# EAGLE design ESP32_Thing_Plus (EAGLE 9.6.2)
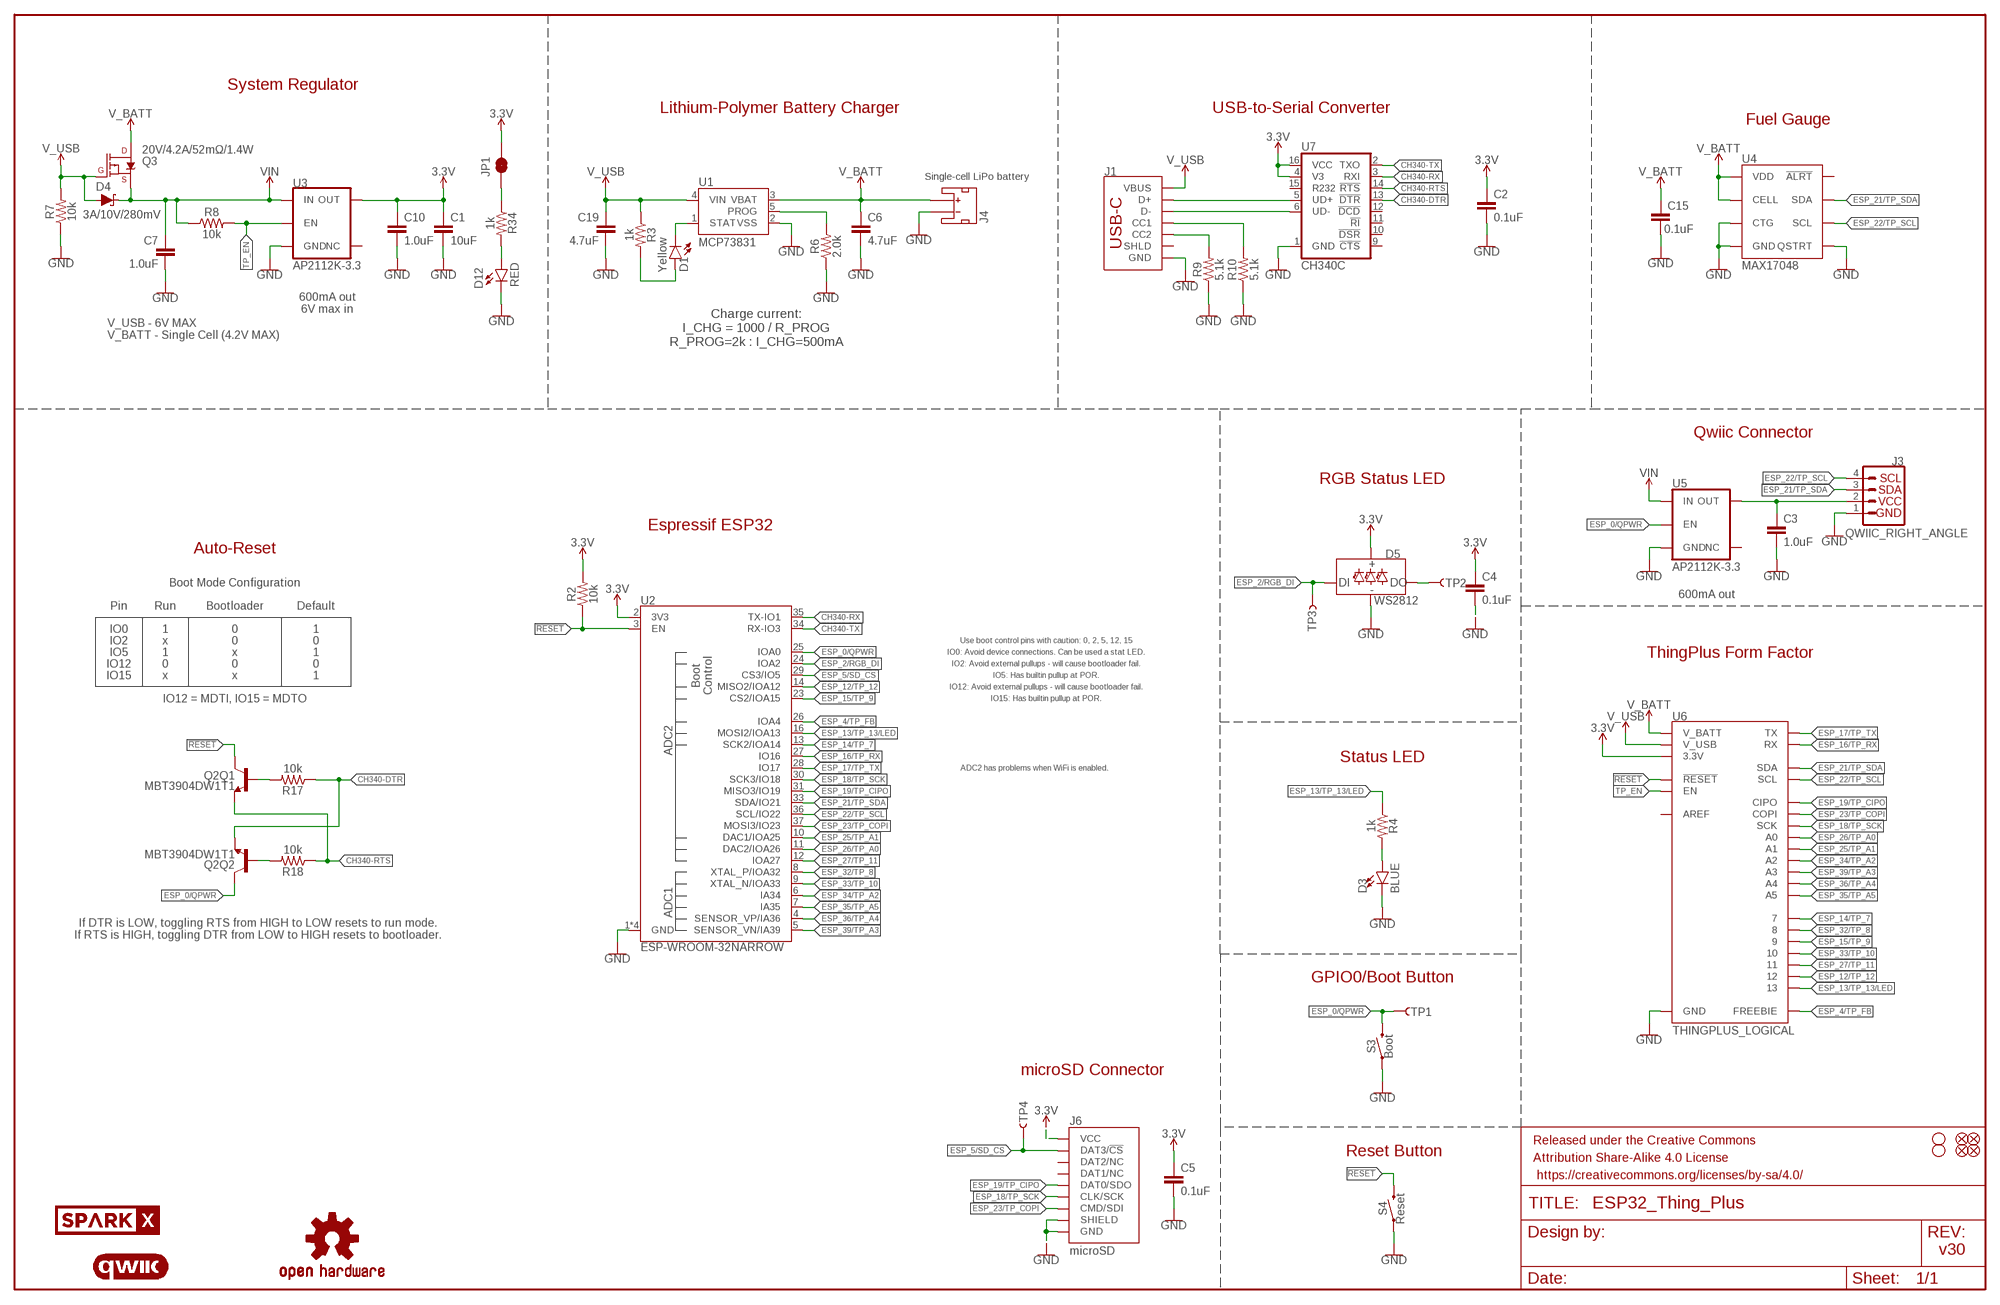
[diagram p0: schematic, sheet 1, part 1 of 2]
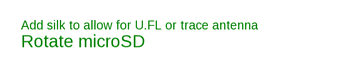
[diagram p1: schematic, sheet 1, part 2 of 2]

## Parts
C1  10uF  10UF-0402T-6.3V-20%  [0402-TIGHT]
C2  0.1uF  0.1UF-0402T-6.3V-10%-X7R  [0402-TIGHT]
C3  1.0uF  1.0UF-0402T-16V-10%  [0402-TIGHT]
C4  0.1uF  0.1UF-0402T-6.3V-10%-X7R  [0402-TIGHT]
C5  0.1uF  0.1UF-0402T-6.3V-10%-X7R  [0402-TIGHT]
C6  4.7uF  4.7UF-0402_TIGHT-6.3V-20%-X5R  [0402-TIGHT]
C7  1.0uF  1.0UF-0402T-16V-10%  [0402-TIGHT]
C10  1.0uF  1.0UF-0402T-16V-10%  [0402-TIGHT]
C15  0.1uF  0.1UF-0402T-16V-10%  [0402-TIGHT]
C19  4.7uF  4.7UF-0603-35V-(20%)  [0603]
D1  Yellow  LED-YELLOW0603  [LED-0603]
D3  BLUE  LED-BLUE0603  [LED-0603]
D4  3A/10V/280mV  DIODE-SCHOTTKY-BAT60A  [SOD-323]
D5  WS2812  WS2812_2020  [WS2812-2020]
D12  RED  LED-RED0603  [LED-0603]
FD1  FIDUCIALUFIDUCIAL  [FIDUCIAL-MICRO]
FD2  FIDUCIALUFIDUCIAL  [FIDUCIAL-MICRO]
FD3  FIDUCIALUFIDUCIAL  [FIDUCIAL-MICRO]
FD4  FIDUCIALUFIDUCIAL  [FIDUCIAL-MICRO]
FRAME1  FRAME-LEDGER  [CREATIVE_COMMONS]
H1  STAND-OFFTIGHT  [STAND-OFF-TIGHT]
H2  STAND-OFFTIGHT  [STAND-OFF-TIGHT]
J1  USB_C_2-LAYER_PADS  [USB-C-16P-2LAYER-PADS]
J3  QWIIC_RIGHT_ANGLE  QWIIC_CONNECTORJS-1MM  [JST04_1MM_RA]
J4  JST_2MM_MALE  [JST-2-SMD]
J6  microSD  MICRO-SD-SDIOPUSH-PUSH  [MICRO-SD-SOCKET]
JP1  JUMPER-SMT_2_NC_TRACE_SILK  [SMT-JUMPER_2_NC_TRACE_SILK]
LOGO2  OSHW-LOGOMINI  [OSHW-LOGO-MINI]
LOGO4  QWIIC_LOGO_4MM  [QWIIC_4MM]
Q2  MBT3904DW1T1  TRANS_NPN_DUAL-MBT3904DW1T1  [SC70-6]
Q3  20V/4.2A/52mΩ/1.4W  MOSFET_PCH-DMG2305UX-7  [SOT23-3]
R2  10k  10KOHM-0402T-1/16W-1%  [0402-TIGHT]
R3  1k  1KOHM-0402T-1/16W-1%  [0402-TIGHT]
R4  1k  1KOHM-0402T-1/16W-1%  [0402-TIGHT]
R6  2.0k  2.0KOHM-0603-1/10W-5%  [0603]
R7  10k  10KOHM-0402T-1/16W-1%  [0402-TIGHT]
R8  10k  10KOHM-0402T-1/16W-1%  [0402-TIGHT]
R9  5.1k  5.1KOHM-0402T-1/16W-1%  [0402-TIGHT]
R10  5.1k  5.1KOHM-0402T-1/16W-1%  [0402-TIGHT]
R17  10k  10KOHM-0402T-1/16W-1%  [0402-TIGHT]
R18  10k  10KOHM-0402T-1/16W-1%  [0402-TIGHT]
R34  1k  1KOHM-0402T-1/16W-1%  [0402-TIGHT]
S3  Boot  MOMENTARY-SWITCH-SPST-SMD-4.6X2.8MM  [TACTILE_SWITCH_SMD_4.6X2.8MM]
S4  Reset  MOMENTARY-SWITCH-SPST-SMD-4.6X2.8MM  [TACTILE_SWITCH_SMD_4.6X2.8MM]
TP1  TEST-POINT3X5  [PAD.03X.05]
TP2  TEST-POINT3X5  [PAD.03X.05]
TP3  TEST-POINT3X5  [PAD.03X.05]
TP4  TEST-POINT3X5  [PAD.03X.05]
U1  MCP73831  [SOT23-5]
U2  ESP-WROOM-32NARROW  [ESP-WROOM-32-NARROW]
U3  AP2112K-3.3  V_REG_AP2112K-3.3V  [SOT23-5]
U4  MAX17048  MAX17048DFN8  [DFN-8]
U5  AP2112K-3.3  V_REG_AP2112K-3.3V  [SOT23-5]
U6  THINGPLUS_LOGICAL  [THINGPLUS_FOOTPRINT]
U7  CH340C  [SO016]
U$1  SPARKX-LOGO4  [SPARKX-MEDIUM]

## Nets
3.3V [power]: C1.1 C2.1 C4.1 C5.1 C10.1 D5.VCC J6.VCC JP1.2 R2.2 U2.2(3V3) U3.5(OUT) U6.3V3(3.3V) U7.4(V3) U7.16(VCC)
!RESET!: Q2.3(Q1:C) R2.1 S4.3 S4.4 U2.3(EN) U6.RST(!RESET)
CH340-DTR: Q2.1(Q2:E) R17.1 U7.13(!DTR)
CH340-RTS: Q2.4(Q1:E) R18.1 U7.14(!RTS)
CH340-RX: U2.35(TX-IO1) U7.3(RXI)
CH340-TX: U2.34(RX-IO3) U7.2(TXO)
CHG: D1.C U1.1(STAT)
CHG_LED: D1.A R3.2
D+: J1.A6(D+) J1.B6(D+) U7.5(UD+)
D-: J1.A7(D-) J1.B7(D-) U7.6(UD-)
DTR-10K: Q2.5(Q1:B) R17.2
ESP_0/QPWR: Q2.6(Q2:C) S3.3 S3.4 TP1.P$1 U2.25(IOA0) U5.3(EN)
ESP_2/RGB_DI: D5.DI TP3.P$1 U2.24(IOA2)
ESP_4/TP_FB: U2.26(IOA4) U6.FREEBIE
ESP_5/SD_CS: J6.CS/DAT3(DAT3/!CS!) TP4.P$1 U2.29(CS3/IO5)
ESP_12/TP_12: U2.14(MISO2/IOA12) U6.12
ESP_13/TP_13/LED: R4.1 U2.16(MOSI2/IOA13) U6.13
ESP_14/TP_7: U2.13(SCK2/IOA14) U6.7
ESP_15/TP_9: U2.23(CS2/IOA15) U6.9
ESP_16/TP_RX: U2.27(IO16) U6.RX
ESP_17/TP_TX: U2.28(IO17) U6.TX
ESP_18/TP_SCK: J6.SCLK(CLK/SCK) U2.30(SCK3/IO18) U6.SCK
ESP_19/TP_CIPO: J6.DO/DAT0(DAT0/SDO) U2.31(MISO3/IO19) U6.CIPO
ESP_21/TP_SDA: J3.3 U2.33(SDA/IO21) U4.8(SDA) U6.SDA
ESP_22/TP_SCL: J3.4 U2.36(SCL/IO22) U4.7(SCL) U6.SCL
ESP_23/TP_COPI: J6.DI/CMD(CMD/SDI) U2.37(MOSI3/IO23) U6.COPI
ESP_25/TP_A1: U2.10(DAC1/IOA25) U6.A1
ESP_26/TP_A0: U2.11(DAC2/IOA26) U6.A0
ESP_27/TP_11: U2.12(IOA27) U6.11
ESP_32/TP_8: U2.8(XTAL_P/IOA32) U6.8
ESP_33/TP_10: U2.9(XTAL_N/IOA33) U6.10
ESP_34/TP_A2: U2.6(IA34) U6.A2
ESP_35/TP_A5: U2.7(IA35) U6.A5
ESP_36/TP_A4: U2.4(SENSOR_VP/IA36) U6.A4
ESP_39/TP_A3: U2.5(SENSOR_VN/IA39) U6.A3
GND: C1.2 C2.2 C3.2 C4.2 C5.2 C6.2 C7.2 C10.2 C15.2 C19.2 D3.C D5.GND D12.C J1.GND J1.GND2(GND) J3.1 J4.1(-) J6.CD1(SHIELD) J6.GND J6.GND1(GND) J6.GND3(GND) R6.1 R7.1 R9.1 R10.1 S3.1 S3.2 S4.1 S4.2 U1.2(VSS) U2.1(GND) U2.15(GND) U2.38(GND) U2.GND U3.2(GND) U4.1(CTG) U4.4(GND) U4.6(QSTRT) U4.9(GND) U5.2(GND) U6.GND U7.1(GND)
N$1: JP1.1 R34.1
N$2: D3.A R4.2
N$3: D5.DO TP2.P$1
N$5: J1.B5(CC2) R9.2
N$6: J1.A5(CC1) R10.2
N$14: R6.2 U1.5(PROG)
N$30: D12.A R34.2
QWIIC_PWR [power]: C3.1 J3.2 U5.5(OUT)
RTS-10K: Q2.2(Q2:B) R18.2
TP_EN: R8.2 U3.3(EN) U6.EN
V_BATT [power]: C6.1 C15.1 J4.2(+) Q3.3(D) U1.3(VBAT) U4.2(CELL) U4.3(VDD) U6.V_BATT
V_USB [power]: C19.1 D4.A J1.VBUS1(VBUS) J1.VBUS2(VBUS) Q3.1(G) R3.1 R7.2 U1.4(VIN) U6.V_USB
VIN [power]: C7.1 D4.C Q3.2(S) R8.1 U3.1(IN) U5.1(IN)
Unconnected: J1.SHLD1(SHLD) J1.SHLD2(SHLD) J1.SHLD3(SHLD) J1.SHLD4(SHLD) J4.NC1(PAD1) J4.NC2(PAD2) J6.DAT1(DAT1/NC) J6.DAT2(DAT2/NC) U3.4(NC) U4.5(!ALRT) U5.4(NC) U6.AREF U7.9(!CTS) U7.10(!DSR) U7.11(!RI) U7.12(!DCD) U7.15(R232)

## Notes on the sheet
- System Regulator
- Lithium-Polymer Battery Charger | USB-to-Serial Converter
- Fuel Gauge
- Single-cell LiPo battery
- 600mA out
  6V max in
- Charge current:
  I_CHG = 1000 / R_PROG
  R_PROG=2k : I_CHG=500mA
- V_USB - 6V MAX
  V_BATT - Single Cell (4.2V MAX)
- Qwiic Connector
- RGB Status LED
- Espressif ESP32
- Auto-Reset
- Boot Mode Configuration
- 600mA out
- Pin | Run | Bootloader | Default
- IO0 | 1 | 0 | 1
- IO2 | x | 0 | 0 | Use boot control pins with caution: 0, 2, 5, 12, 15
- IO5 | 1 | x | 1 | IO0: Avoid device connections. Can be used a stat LED. | ThingPlus Form Factor
- IO12 | 0 | 0 | 0 | IO2: Avoid external pullups - will cause bootloader fail.
- IO15 | x | x | 1 | IO5: Has builtin pullup at POR.
- IO12: Avoid external pullups - will cause bootloader fail. | Add silk to allow for U.FL or trace antenna
- IO12 = MDTI, IO15 = MDTO | IO15: Has builtin pullup at POR. | Rotate microSD
- Status LED
- ADC2 has problems when WiFi is enabled.
- If DTR is LOW, toggling RTS from HIGH to LOW resets to run mode.
  If RTS is HIGH, toggling DTR from LOW to HIGH resets to bootloader.
- GPIO0/Boot Button
- microSD Connector
- Reset Button
- v30

## Library data of the parts
C1 = SparkFun-Capacitors:10UF: 10.0µF ceramic capacitors A capacitor is a passive two-terminal electrical component used to store electrical energy temporarily in an electric field.; PROD_ID: CAP-14848
C2 C4 C5 = SparkFun-Capacitors:0.1UF: 0.1µF ceramic capacitors A capacitor is a passive two-terminal electrical component used to store electrical energy temporarily in an electric field.; PROD_ID: CAP-14993
C3 C7 C10 = SparkFun-Capacitors:1.0UF: 1µF ceramic capacitors A capacitor is a passive two-terminal electrical component used to store electrical energy temporarily in an electric field.; PROD_ID: CAP-12417
C6 = SparkFun-Capacitors:4.7UF: 4.7µF ceramic capacitors A capacitor is a passive two-terminal electrical component used to store electrical energy temporarily in an electric field.; PROD_ID: CAP-14240
C15 = SparkFun-Capacitors:0.1UF: 0.1µF ceramic capacitors A capacitor is a passive two-terminal electrical component used to store electrical energy temporarily in an electric field.; PROD_ID: CAP-12416
C19 = SparkFun-Capacitors:4.7UF: 4.7µF ceramic capacitors A capacitor is a passive two-terminal electrical component used to store electrical energy temporarily in an electric field.; PROD_ID: CAP-14106
D1 = SparkFun-LED:LED-YELLOW: Yellow SMD LED Used in manufacturing several products at SparkFun. Packages: 0603 - SMD 0603 package[Product Link] <http://www.kingbrightusa.com/product.asp?catalog_name=LED&product_id=APT1608SYCK> 0603 -SMART - SMART SMD 0603 package (more efficient/more expensive) [Product Link] <http://www.osram-os.com/osram_os/en/products/product-catalog/led-light-emitting-diodes/smartled-0603/ly-l29k/index.jsp> LilyPad - SMD1206 package[Product Datasheet] <https://www.sparkfun.com/datasheets/DevTools/LilyPad/Q150YUS4.pdf> SparkFun Products: Blynk Board <https://www.sparkfun.com/products/13794> IOIO-OTG <https://www.sparkfun.com/products/13613> XBee Explorer Serial <https://www.sparkfun.com/products/13225>; PROD_ID: DIO-09003
D3 = SparkFun-LED:LED-BLUE: Blue SMD LED Used in manufacturing of various products at SparkFun Packages: 0603 - SMD 0603 package [Product Link] <http://www.digikey.com/product-detail/en/SMLE12BC7TT86/511-1589-2-ND/1641808> 1206 - SMD1206 package [Product Link] <http://www.digikey.com/product-detail/en/lite-on-inc/LTST-C150TBKT/160-1643-1-ND/573584> SparkFun Products: ESP8266 Thing-Dev Board <https://www.sparkfun.com/products/13711> RedBoard <https://www.sparkfun.com/products/12757>; PROD_ID: DIO-08575
D4 = SparkFun-DiscreteSemi:DIODE-SCHOTTKY: Schottky diode A Schottky diode is a semiconductor diode which has a low forward voltage drop and a very fast switching action.; PROD_ID: DIO-14072
D5 = SparkFun-LED:WS2812: Addressable RGB LED - 1 Wire Common names: WS2812, SK6812, Neopixel, APA-106, etc. SMD LED with built-in controller IC. Color: Red/Green/Blue SparkFun Products: LED-SMD RGB (WS2812) <https://www.sparkfun.com/products/11821> LED - RGB Addressable, PTH, 5mm Diffused (5 Pack) <https://www.sparkfun.com/products/12986> LED - RGB Addressable, PTH, 5mm Clear (5 Pack) <https://www.sparkfun.com/products/12999> Blynk Board - ESP8266 <https://www.sparkfun.com/products/13794> Datasheet referenced for footprint: WS2812B-PTH <https://cdn.sparkfun.com/datasheets/Components/LED/COM-12877.pdf>; PROD_ID: DIO-15591
D12 = SparkFun-LED:LED-RED: Red SMD LED Used in manufacturing of most products at SparkFun Packages: 0603 - SMD 0603 package [Product Link] <http://docs.avagotech.com/docs/AV02-0551EN> 0603 SMART - SMD 0603 SMART package ( more efficient and expensive)[Product Link] <http://www.osram-os.com/Graphics/XPic2/00077099_0.pdf> 1206 - SMD1206 package [Product Link] <https://www.sparkfun.com/datasheets/DevTools/LilyPad/Q150OVS4.pdff> SparkFun Products: Pro Mini 328 -5V <https://www.sparkfun.com/products/821> RedBoard <https://www.sparkfun.com/products/12757> IOIO-OTG <https://www.sparkfun.com/products/13613>; PROD_ID: DIO-00819
FD1-FD4 = SparkFun-Aesthetics:FIDUCIAL: Fiducial Alignment Points Point-of-reference for pick-and-place machines and other optical instruments.
FRAME1 = SparkFun-Aesthetics:FRAME-LEDGER: Schematic Frame - Ledger Standard 11x14 US Ledger frame
H1 H2 = SparkFun-Hardware:STAND-OFF: Stand Off Drill holes for mechanically mounting via screws, standoffs, etc. Note: Use the keepout ring to avoid running the screw head into surrounding components. Variant Overviews STAND-OFF - Mechanical footprint for a #4 phillips button head screw. STAND-OFF-TIGHT - Mechanical footprint for a #4 phillips button head screw, Example SparkFun Products Screw - Phillips Head (1/4", 4-40, 10 pack) <https://www.sparkfun.com/products/10453> (PRT-10453) Screw - Phillips Head (1/2", 4-40, 10 pack) <https://www.sparkfun.com/products/10452> (PRT-10452) Screw - Phillips Head (3/4", 4-40, 10 pack) <https://www.sparkfun.com/products/10451> (PRT-10451) Screw - Phillips Head (1", 4-40, 10 pack) <https://www.sparkfun.com/products/10450> (PRT-10450)
J1 = SparkFun-Connectors:USB_C: USB Type C 16Pin Connector Super Speed pins not available on the 16-pin purely SMD connector so this part is best for USB 2.0 implementations. D1 and D2 are tied together enabling D+/- no matter which way the cable is plugged into the connector. The two channel configuration pins (CC1/2) are exposed. These are normally connected to ground via 5.1k resistors but can be reconfigured for high current/high power applications. **4-LAYER BOARD WARNING!!** If designing 4-layer board, make sure to select the variant _4-LAYER-ISOLATED. The linked footprint (USB-C-16-4LAYER-ISOLATED) includes some very necessary cutout polygons in the inner layers (2 and 15). This prevents the PTH mounting shield legs on the USB connector from electrically connecting any other polygons on the inner layers (usually VCC and GND).; PROD_ID: CONN-14122
J3 = SparkFun-Connectors:QWIIC_CONNECTOR: SparkFun I2C Standard Qwiic Connector An SMD 1mm pitch JST connector makes it easy and quick (get it? Qwiic?) to connect I2C devices to each other. The Qwiic system <http://www.sparkfun.com/qwiic> enables fast and solderless connection between popular platforms and various sensors and actuators. We carry 200mm <https://www.sparkfun.com/products/14204>, 100mm <https://www.sparkfun.com/products/14205>, 50mm <https://www.sparkfun.com/products/14206>, and breadboard friendly <https://www.sparkfun.com/products/14207> Qwiic cables. We also offer 10 pcs strips <https://www.sparkfun.com/products/14323> the SMD connectors.; PROD_ID: CONN-13694
J4 = SparkFun-Connectors:JST_2MM_MALE: JST 2MM MALE RA CONNECTOR Two pin, compact surface mount connector. Commonly used as a battery input connection point. We really like the solid locking feeling and high current rating on these small connectors. We use these all the time as battery connectors. Mates to single-cell LiPo batteries. Here is the connector we sell at SparkFun: JST Right Angle Connector - White <https://www.sparkfun.com/products/8612> (PRT-08612) Datasheet <http://www.sparkfun.com/datasheets/Prototyping/Connectors/JST-Horizontal.pdf> It was used on these SparkFun products: SparkFun MOSFET Power Controller <https://www.sparkfun.com/products/11214> (PRT-11214) SparkFun Battery Babysitter - LiPo Battery Manager <https://www.sparkfun.com/products/13777> (PRT-13777) And many, many others that required a lipo battery connection.; PROD_ID: CONN-11443; SF_ID: PRT-08612
J6 = SparkFun-Connectors:MICRO-SD-SDIO: microSD Socket for Transflash Push-push type µSD socket. tDoc lines correctly indicate media card edge positions when inserting (unlocked, locked, depressed). NOTE: CD1 and CD2 are connected internally, and the default detect state of the socket is detect pin to ground. SparkFun Products: WAV Trigger <https://www.sparkfun.com/products/13660> CAN-Bus Shield <https://www.sparkfun.com/products/13262> SparkFun Level Shifing microSD Breakout <https://www.sparkfun.com/products/13743>; PROD_ID: CONN-07820
JP1 = SparkFun-Jumpers:JUMPER-SMT_2_NC_TRACE: Normally closed trace jumper This jumper has a trace between two pads so it's normally closed (NC). Use a razor knife to open the connection. For best results follow the IPC guidelines for cutting traces: Cutout at least 0.063 mm (0.005 in). Remove all loose material to clean up the cut area. Seal the cut with an approved epoxy. Reapply solder to reclose the connection.
LOGO2 = SparkFun-Aesthetics:OSHW-LOGO: Open-Source Hardware (OSHW) Logo This logo indicates the piece of hardware it is found on incorporates a OSHW license and/or adheres to the definition of open source hardware found here: http://freedomdefined.org/OSHW
LOGO4 = SparkFun-Aesthetics:QWIIC_LOGO: Qwiic Logos for placement on schematic and PCB. The 5.5mm silk logo is best for placing next to Qwiic connector.
Q2 = SparkFun-DiscreteSemi:TRANS_NPN_DUAL: Dual NPN Transistors in Single Package The MBT3904W1 puts two general purpose 3904 NPN transistors in a single package. Datasheet <http://www.onsemi.com/pub_link/Collateral/MBT3904DW1T1-D.PDF> SparkFun Products: SparkFun ESP32 Thing <https://www.sparkfun.com/products/13907>; PROD_ID: TRANS-13337
Q3 = SparkFun-DiscreteSemi:MOSFET_PCH: P-channel MOSFETs Voltage controlled devices that allow control of high current outputs. SparkFun Products: SparkFun ESP32 Thing <https://www.sparkfun.com/products/13907> SparkFun ESP8266 Thing <https://www.sparkfun.com/products/13231> SparkFun Pi Servo HAT V2 <https://www.sparkfun.com/products/15316> DMG2305UX-7 (20V/4.2A/SOT23-3); PROD_ID: TRAN-14388
R2 R7 R8 R17 R18 = SparkFun-Resistors:10KOHM: 10kΩ resistor A resistor is a passive two-terminal electrical component that implements electrical resistance as a circuit element. Resistors act to reduce current flow, and, at the same time, act to lower voltage levels within circuits. - Wikipedia; PROD_ID: RES-14241
R3 R4 R34 = SparkFun-Resistors:1KOHM: 1kΩ resistor A resistor is a passive two-terminal electrical component that implements electrical resistance as a circuit element. Resistors act to reduce current flow, and, at the same time, act to lower voltage levels within circuits. - Wikipedia; PROD_ID: RES-14342
R6 = SparkFun-Resistors:2.0KOHM: 2kΩ resistor A resistor is a passive two-terminal electrical component that implements electrical resistance as a circuit element. Resistors act to reduce current flow, and, at the same time, act to lower voltage levels within circuits. - Wikipedia; PROD_ID: RES-08296
R9 R10 = SparkFun-Resistors:5.1KOHM; PROD_ID: RES-14340
S3 S4 = SparkFun-Switches:MOMENTARY-SWITCH-SPST: Momentary Switch (Pushbutton) - SPST Normally-open (NO) SPST momentary switches (buttons, pushbuttons). Variants PTH-12MM - 12mm square, through-hole Momentary Pushbutton Switch - 12mm Square <https://www.sparkfun.com/products/9190> (COM-09190) PTH-6.0MM, PTH-6.0MM-KIT - 6.0mm square, through-hole Mini Pushbutton Switch <https://www.sparkfun.com/products/97> (COM-00097) KIT package intended for soldering kit's - only one side of pads' copper is exposed. PTH-RIGHT-ANGLE-KIT - Right-angle, through-hole Right Angle Tactile Button <https://www.sparkfun.com/products/10791> - Used on SparkFun BigTime Watch Kit <https://www.sparkfun.com/products/11734> SMD-12MM - 12mm square, surface-mount Tactile Button - SMD (12mm) <https://www.sparkfun.com/products/12993> (COM-12993) Used on SparkFun PicoBoard <https://www.sparkfun.com/products/11888> SMD-4.5MM - 4.5mm Square Trackball Switch Used on SparkFun Blackberry Trackballer Breakout <https://www.sparkfun.com/products/13169> SMD-4.6MMX2.8MM - 4.60mm x 2.80mm, surface mount Used on SparkFun SAMD21 Mini Breakout <https://www.sparkfun.com/products/13664> SMD-5.2MM, SMD-5.2-REDUNDANT - 5.2mm square, surface-mount Mini Pushbutton Switch - SMD <https://www.sparkfun.com/products/8720> (COM-08720) Used on Arduino Pro Mini <https://www.sparkfun.com/products/11114> REDUNDANT package connects both switch circuits together SMD-6.0X3.5MM - 6.0 x 3.5mm, surface mount Momentary Reset Switch SMD <https://www.sparkfun.com/products/8229> (COM-08229) SMD-6.2MM-TALL - 6.2mm square, surface mount Tactile Button - SMD (6mm) <https://www.sparkfun.com/products/12992> Used on SparkFun Digital Sandbox <https://www.sparkfun.com/products/12651> SMD-RIGHT-ANGLE - Right-angle, surface mount Used on SparkFun Block for Intel® Edison - Arduino <https://www.sparkfun.com/products/13036>; PROD_ID: SWCH-15606
TP1-TP4 = SparkFun-Connectors:TEST-POINT: SparkFun Test Points Bare copper test points for troubleshooting or In-Circuit-Testing. These are used by our Production team for verifying production board runs using pogo-pins on test beds. SparkFun Products: SparkFun LSM9DS1 Breakout <https://www.sparkfun.com/products/13284> SparkFun PSOC <https://www.sparkfun.com/products/13714> SparkFun Load Cell Amplifier <https://www.sparkfun.com/products/13879>
U1 = SparkFun-PowerIC:MCP73831: Miniature single cell, fully integrated Li-Ion, Li-polymer charge management controller http://ww1.microchip.com/downloads/en/DeviceDoc/20001984g.pdf IC-09995; PROD_ID: IC-09995
U2 = SparkFun-RF:ESP-WROOM-32; PROD_ID: IC-13849
U3 U5 = SparkFun-IC-Power:V_REG_AP2112: AP2112 - 600mA CMOS LDO Regulator w/ Enable The AP2112 is CMOS process low dropout linear regulator with enable function, the regulator delivers a guaranteed 600mA (min.) continuous load current. Features Output Voltage Accuracy: ±1.5% Output Current: 600mA (Min.) Foldback Short Current Protection: 50mA Enable Function to Turn ON/OFF VOUT Low Dropout Voltage (3.3V): 250mV (Typ.) @IOUT=600mA Excellent Load Regulation: 0.2%/A (Typ.) Excellent Line Regulation: 0.02%/V (Typ.) Low Quiescent Current: 55μA (Typ.) Low Standby Current: 0.01μA (Typ.) Low Output Noise: 50μVRMS PSRR: 100Hz -65dB, 1kHz -65dB OTSD Protection Stable with 1.0μF Flexible Cap: Ceramic, Tantalum and Aluminum Electrolytic Operation Temperature Range: -40°C to 85°C ESD: MM 400V, HBM 4000V; PROD_ID: VREG-12457; VALUE: 3.3V
U4 = SparkFun-IC-Power:MAX17048: Micropower 1-Cell Li+ ModelGauge SparkFun Products Qduino Mini <https://www.sparkfun.com/products/13614> (DEV-13614); PROD_ID: IC-12551
U6 = ThingPlus:THINGPLUS_LOGICAL
U7 = SparkFun-IC-Comms:CH340C; PROD_ID: IC-14038
U$1 = SparkX:SPARKX-LOGO

## Net classes
0 default: width 0.127 mm, drill 0.305 mm
1 power: width 0.305 mm, drill 0.305 mm

## Board
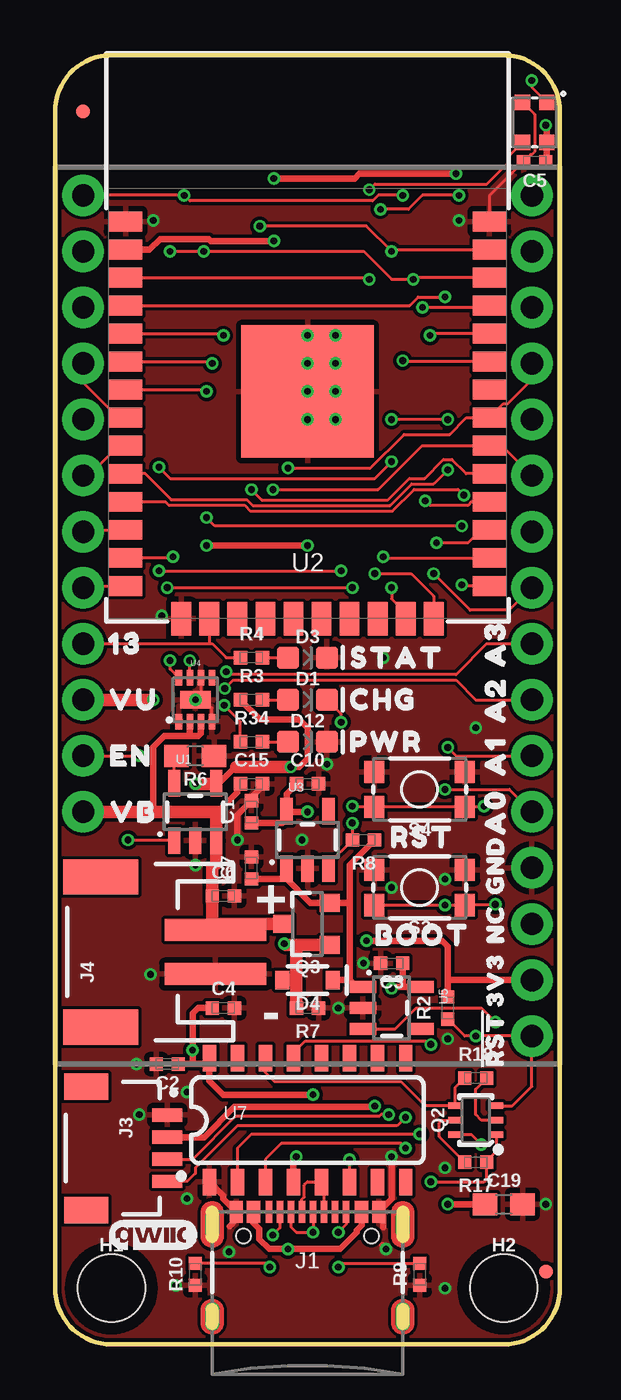
[diagram p2: board, top side]
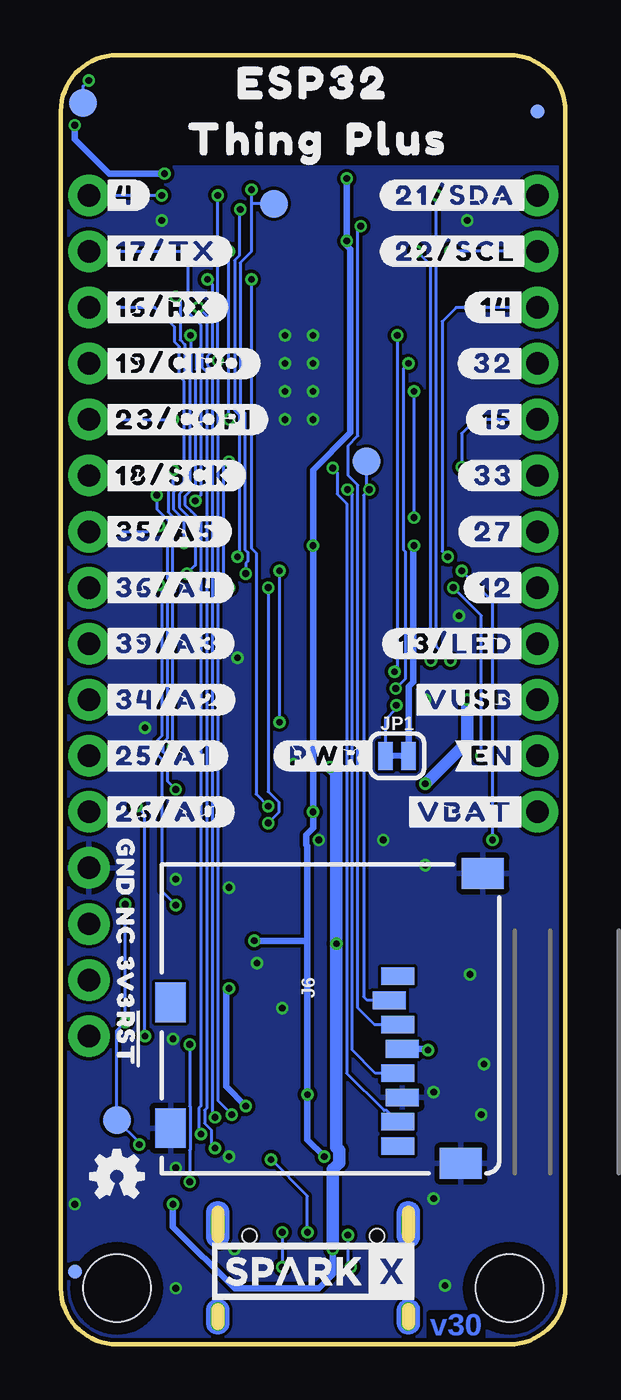
[diagram p3: board, bottom side, seen from below]

Size 22.86 x 58.42 mm. Coordinates in mm from the lower left corner, seen from the top.
Outline: 22.86,2.54 22.86,55.88 arc90 20.32,58.42 2.54,58.42 arc90 0,55.88 0,2.54 arc90 2.54,0 20.32,0 arc90 22.86,2.54
Copper layers (1*16): Top/Horz 0.035mm / dielectric 1.5mm / Bottom/Vert 0.035mm
Design rules "SparkFun-2-Layer-Minimum-JLCPCB": minimum track width 5mil, minimum drill 0.3mm, track to track 5mil, track to pad 5mil, pad to pad 5mil, via to via 5mil, smd to smd 5mil, copper to edge 7mil, drill to drill 7mil, minimum pad ring 5mil, minimum via ring 5mil, stop-mask expansion 4mil, vias tented up to drill 25mil, thermal gap 10mil

### Footprints (pad centres in the part's own frame; a part is rotated, then mirrored left to right if it is on the bottom)
0402-TIGHT = smd 0.6 x 0.6: 1 -0.5,0; 2 0.5,0
0603 = smd 1.1 x 1: 1 -0.85,0; 2 0.85,0
LED-0603 = smd 1 x 1: A -0.877,0; C 0.877,0
SOD-323 = smd 0.63 x 0.83: A 1.15,0; C -1.15,0
WS2812-2020 = smd 0.7 x 0.7: DI -0.915,0.55; DO 0.915,-0.55; GND 0.915,0.55; VCC -0.915,-0.55
FIDUCIAL-MICRO = smd 0.635 x 0.635: 1 0,0
STAND-OFF-TIGHT = hole 3.048: 0,0
USB-C-16P-2LAYER-PADS = smd 0.3 x 1: A5 -1.25,-0.34; A6 -0.25,-0.34; A7 0.25,-0.34; A8 1.25,-0.34; B5 1.75,-0.34; B6 0.75,-0.34; B7 -0.75,-0.34; B8 -1.75,-0.34 | smd 0.6 x 1: GND -3.225,-0.34; GND2 3.225,-0.34; VBUS1 -2.45,-0.34; VBUS2 2.45,-0.34 | drill 0.4 pad 0.6 long: SHLD1 -4.318,-0.915; SHLD2 4.318,-0.915; SHLD3 -4.318,-5.095; SHLD4 4.318,-5.095 | hole 0.65: -2.89,-1.445; 2.89,-1.445
JST04_1MM_RA = smd 0.6 x 1.35: 1 -1.5,0; 2 -0.5,0; 3 0.5,0; 4 1.5,0 | smd 1.2 x 2: NC1 2.8,-3.675; NC2 -2.8,-3.675
JST-2-SMD = smd 1 x 4.6: 1 -1,-3.7; 2 1,-3.7 | smd 1.6 x 3.4: NC1 -3.4,1.5; NC2 3.4,1.5
MICRO-SD-SOCKET = smd 1.8 x 1.4: CD1 -2.05,0.4; CD2 -7.75,0.4 | smd 0.8 x 1.5: CS/DAT3 -7.84,10.3; DAT1 -1.24,10.7; DAT2 -8.94,10.7; DI/CMD -6.74,10.7; DO/DAT0 -2.34,10.7; GND -3.44,10.9; SCLK -4.54,10.7; VCC -5.64,10.9 | smd 1.4 x 1.9: GND1 -13.6,14.55; GND3 -0.45,13.55
SMT-JUMPER_2_NC_TRACE_SILK = smd 0.66 x 1.27: 1 -0.521,0; 2 0.521,0
SC70-6 = smd 0.3 x 0.66: 1 -0.65,-0.92; 2 0,-0.92; 3 0.65,-0.92; 4 0.65,0.92; 5 0,0.92; 6 -0.65,0.92
SOT23-3 = smd 0.8 x 0.9: 1 -0.95,-1; 2 0.95,-1; 3 0,1.1
TACTILE_SWITCH_SMD_4.6X2.8MM = smd 0.9 x 1: 1 -2.05,-0.8; 2 2.05,-0.8; 3 2.05,0.8; 4 -2.05,0.8
PAD.03X.05 = smd 1.27 x 1.27: P$1 0,0
SOT23-5 = smd 0.55 x 1.2: 1 -0.95,-1.3; 2 0,-1.3; 3 0.95,-1.3; 4 0.95,1.3; 5 -0.95,1.3
ESP-WROOM-32-NARROW = smd 0.9 x 1.5: 1 6.43,8.238; 2 5.16,8.238; 3 3.89,8.238; 4 2.62,8.238; 5 1.35,8.238; 6 0.08,8.238; 7 -1.19,8.238; 8 -2.46,8.238; 9 -3.73,8.238; 10 -5,8.238; 11 -6.27,8.238; 12 -7.54,8.238; 13 -8.81,8.238; 14 -10.08,8.238; 25 -10.08,-8.238; 26 -8.81,-8.238; 27 -7.54,-8.238; 28 -6.27,-8.238; 29 -5,-8.238; 30 -3.73,-8.238; 31 -2.46,-8.238; 32 -1.19,-8.238; 33 0.08,-8.238; 34 1.35,-8.238; 35 2.62,-8.238; 36 3.89,-8.238; 37 5.16,-8.238; 38 6.43,-8.238 | smd 1.5 x 0.9: 15 -11.57,5.715; 16 -11.57,4.445; 17 -11.57,3.175; 18 -11.57,1.905; 19 -11.57,0.635; 20 -11.57,-0.635; 21 -11.57,-1.905; 22 -11.57,-3.175; 23 -11.57,-4.445; 24 -11.57,-5.715 | smd 6 x 6: GND -1.27,0
DFN-8 = smd 0.3 x 0.7: 1 -0.75,-0.99; 2 -0.25,-0.99; 3 0.25,-0.99; 4 0.75,-0.99; 5 0.75,0.99; 6 0.25,0.99; 7 -0.25,0.99; 8 -0.75,0.99 | smd 1.38 x 0.8: 9 0,0
THINGPLUS_FOOTPRINT = drill 1.016 pad 1.88: 3V3 10.16,-19.05; 7 -10.16,11.43; 8 -10.16,8.89; 9 -10.16,6.35; 10 -10.16,3.81; 11 -10.16,1.27; 12 -10.16,-1.27; 13 -10.16,-3.81; A0 10.16,-11.43; A1 10.16,-8.89; A2 10.16,-6.35; A3 10.16,-3.81; A4 10.16,-1.27; A5 10.16,1.27; AREF 10.16,-16.51; CIPO 10.16,8.89; COPI 10.16,6.35; EN -10.16,-8.89; FREEBIE 10.16,16.51; GND 10.16,-13.97; RST 10.16,-21.59; RX 10.16,11.43; SCK 10.16,3.81; SCL -10.16,13.97; SDA -10.16,16.51; TX 10.16,13.97; V_BATT -10.16,-11.43; V_USB -10.16,-6.35
SO016 = smd 0.6 x 1.2: 1 -4.445,-2.8; 2 -3.175,-2.8; 3 -1.905,-2.8; 4 -0.635,-2.8; 5 0.635,-2.8; 6 1.905,-2.8; 7 3.175,-2.8; 8 4.445,-2.8; 9 4.445,2.8; 10 3.175,2.8; 11 1.905,2.8; 12 0.635,2.8; 13 -0.635,2.8; 14 -1.905,2.8; 15 -3.175,2.8; 16 -4.445,2.8

### Placement (x,y rotation side)
C1  8.89,24.13 90 top
C2  5.08,12.7 180 top
C3  15.24,17.27 180 top
C4  7.62,15.24 0 top
C5  21.72,53.59 180 top
C6  7.62,20.32 0 top
C7  8.89,21.59 90 top
C10  11.43,25.4 0 top
C15  8.89,25.4 0 top
C19  20.32,6.35 0 top
D1  11.43,29.21 0 top
D3  11.43,31.11 0 top
D4  11.43,16.51 180 top
D5  21.72,55.37 90 top
D12  11.43,27.3 0 top
FD1  1.27,55.88 0 top
FD2  1.27,55.88 0 bottom
FD3  22.23,3.3 0 top
FD4  22.23,3.3 0 bottom
FRAME1  -17.14,-19.05 0 top  (outside the outline)
H1  2.54,2.54 0 top
H2  20.32,2.54 0 top
J1  11.43,6.35 0 top
J3  5.08,8.89 270 top
J4  3.56,17.78 90 top
J6  18.29,7.75 270 bottom
JP1  7.62,26.67 0 bottom
LOGO2  20.32,7.62 0 bottom
LOGO4  4.45,4.95 0 top
Q2  19.05,10.16 90 top
Q3  11.43,19.05 90 top
R2  17.78,15.24 90 top
R3  8.89,29.21 0 top
R4  8.89,31.11 0 top
R6  6.35,26.67 180 top
R7  11.43,15.24 180 top
R8  13.97,22.86 180 top
R9  16.51,3.17 90 top
R10  6.35,3.17 90 top
R17  19.05,8.26 180 top
R18  19.05,12.06 0 top
R34  8.89,27.3 0 top
S3  16.51,20.7 180 top
S4  16.51,25.15 180 top
TP1  20.32,10.16 0 bottom
TP2  21.84,56.26 0 bottom
TP3  13.21,51.69 0 bottom
TP4  9.02,40.01 0 bottom
U1  6.35,24.13 0 top
U2  11.43,44.45 90 top
U3  11.43,22.86 0 top
U4  6.35,29.21 0 top
U5  15.24,15.24 270 top
U6  11.43,35.56 0 top
U7  11.43,10.16 0 top
U$1  11.43,3.3 0 bottom
U$23  [3V30]  19.94,16.51 90 top
U$24  [CHG1]  14.86,29.21 0 top
U$25  [PWR2]  14.99,27.3 0 top
U$26  [STAT0]  15.49,31.11 0 top
U$56  [GND1]  19.94,21.59 270 bottom
U$57  [#4#0]  21.08,52.07 0 bottom
U$59  [ORDERING_INSTRUCTIONS]  29.21,50.8 0 top  (outside the outline)
U$62  [#23#COPI#0]  21.08,41.91 0 bottom
U$68  [A03]  19.94,24.13 90 top
U$69  [A12]  19.94,26.67 90 top
U$70  [A21]  19.94,29.21 90 top
U$71  [A30]  19.94,31.75 90 top
U$72  [#17#TX#0]  21.08,49.53 0 bottom
U$73  [VB1]  3.56,24.13 0 top
U$74  [EN3]  3.43,26.67 0 top
U$75  [GND1]  19.94,21.72 90 top
U$76  [VU0]  3.56,29.21 0 top
U$77  [130]  3.17,31.75 0 top
U$78  [BOOT0]  16.64,18.54 0 top
U$79  [#RST#0]  19.81,13.84 90 top
U$80  [RST0]  16.64,22.99 0 top
U$81  [#16#RX#0]  21.08,46.99 0 bottom
U$82  [#19#CIPO#0]  21.08,44.45 0 bottom
U$83  [#18#SCK#0]  21.08,39.37 0 bottom
U$84  [#35#A5#0]  21.08,36.83 0 bottom
U$85  [#36#A4#0]  21.08,34.29 0 bottom
U$86  [#25#A1#2]  21.08,26.67 0 bottom
U$87  [#26#A0#3]  21.08,24.13 0 bottom
U$88  [#34#A2#1]  21.08,29.21 0 bottom
U$89  [#39#A3#0]  21.08,31.75 0 bottom
U$90  [#12#4]  1.65,34.29 0 bottom
U$91  [#14#9]  1.65,46.99 0 bottom
U$92  [#15#7]  1.65,41.91 0 bottom
U$93  [#27#5]  1.65,36.83 0 bottom
U$94  [#32#8]  1.65,44.45 0 bottom
U$95  [#33#6]  1.65,39.37 0 bottom
U$96  [#EN#1]  1.65,26.67 0 bottom
U$97  [#VBAT#0]  1.65,24.13 0 bottom
U$98  [#VUSB#2]  1.65,29.21 0 bottom
U$99  [#13#LED#0]  1.65,31.75 0 bottom
U$100  [#21#SDA#1]  1.52,52.07 0 bottom
U$101  [#22#SCL#0]  1.52,49.53 0 bottom
U$102  [#PWR#0]  8.51,26.67 0 bottom
U$103  [ESP320]  11.43,57.15 0 bottom
U$104  [THING1]  13.97,54.61 0 bottom
U$105  [PLUS2]  7.62,54.61 0 bottom
U$106  [NC0]  19.94,18.92 270 bottom
U$107  [NC0]  19.94,19.05 90 top
U$108  [3V30]  19.94,16.38 270 bottom
U$109  [#RST#0]  19.81,13.84 270 bottom

### Tracks (layer width: path | path; a pad name or v marks a point on that pad's centre or on a via)
3.3V  (via drill 0.3)
  Top/Horz 0.305: C1.1 10.28,23.63 10.29,23.62 10.48,23.82 U3.5 10.48,24.26 | 10.48,24.26 10.48,24.95 C10.1 | U7.4 10.79,8.38 v10.92,8.51 | v11.43,24.13 10.61,24.13 10.48,24.26 | v9.91,50 7.05,50 6.96,50.09 4.75,50.09 4.27,49.61 U2.2 | v18.16,53.05 13.78,53.05 13.56,52.83 v9.91,52.83 | v22.23,55.24 22.27,55.2 D5.VCC 22.27,53.64 C5.1 | v14.1,18.29 17.53,18.29 17.78,18.03 17.78,16.51 | U7.16 6.99,12.7 | 6.99,12.7 6.99,11.94 7.61,11.32 v11.68,11.32 | C2.1 6.22,12.7 | 6.22,12.7 6.99,12.7 | C4.1 6.48,15.24 6.22,14.99 v6.22,13.34 6.22,12.7 | v6.86,36.2 v11.43,36.2 | R2.2 17.78,16.51 | U6.3V3 17.78,16.51
  Bottom/Vert 0.305: v10.92,8.51 11.68,9.27 v11.68,11.32 11.68,18.29 | v9.91,52.83 v9.91,50 9.91,49.78 9.74,49.62 9.74,41.31 11.43,39.62 v11.43,36.2 v11.43,24.13 11.43,23.4 11.73,23.09 11.73,22.63 11.68,22.58 11.68,18.29 | v18.16,53.05 20.66,53.05 22.23,54.61 v22.23,55.24 | J6.VCC 6.28,13.39 v6.22,13.34 | JP1.2 7.1,29.82 6.9,30.02 6.9,36.16 v6.86,36.2 | v14.1,18.29 11.68,18.29
!RESET!  (via drill 0.3)
  Top/Horz 0.127: v19.43,24.38 19.39,24.35 S4.4 S4.3 14.42,24.38 v13.46,24.38 | U2.3 14.14,48.34 v14.22,48.26 | R2.1 18.55,13.97 v19.05,13.97 U6.RST 21.59,11.68 20.72,10.81 Q2.3
  Bottom/Vert 0.127: v19.05,13.97 19.05,24 v19.43,24.38 | v13.46,24.38 14.01,24.93 14.01,35.86 14.22,36.08 v14.22,48.26
CH340-DTR  (via drill 0.3)
  Top/Horz 0.127: U7.13 10.79,13.21 11.34,13.75 16.86,13.75 v17.02,13.59 | Q2.1 19.97,8.75 19.55,8.33 R17.1 19.56,8.25 19.56,7.49 19.43,7.37 v17.02,7.37
  Bottom/Vert 0.127: v17.02,13.59 17.02,10.8 17,10.78 17,8.82 17.02,8.8 v17.02,7.37
CH340-RTS
  Top/Horz 0.127: U7.14 9.53,12.32 9.94,11.9 15.67,11.9 16.76,10.81 Q2.4 18.13,11.64 R18.1
CH340-RX  (via drill 0.3)
  Top/Horz 0.127: U2.35 19.59,46.99 v16.64,46.99 | U7.3 9.53,8.38 10.24,9.1 15.67,9.1 v15.88,8.89
  Bottom/Vert 0.127: v16.64,46.99 16.26,46.61 16.26,45.09 16.47,44.88 16.47,44.28 16.26,44.06 16.26,10.7 16.34,10.61 16.34,10.02 16.04,9.72 16.04,9.05 v15.88,8.89
CH340-TX  (via drill 0.3)
  Top/Horz 0.127: U2.34 17.06,45.8 v16.98,45.72 | v16.51,9.53 8.89,9.53 8.26,8.89 U7.2
  Bottom/Vert 0.127: v16.98,45.72 16.98,44.07 16.76,43.85 16.76,38.89 17.23,38.42 17.23,38.03 16.96,37.76 16.95,37.76 16.51,37.32 16.51,10.8 16.6,10.71 16.6,9.61 v16.51,9.53
CHG  (via drill 0.3)
  Top/Horz 0.127: U1.1 3.33,22.83 v3.3,22.86 | v4.7,35.05 v12.95,35.05 | v12.95,28.19 12.95,28.57 D1.C
  Bottom/Vert 0.127: v4.7,35.05 3.3,33.66 v3.3,22.86 | v12.95,35.05 v12.95,28.19
CHG_LED
  Top/Horz 0.127: R3.2 D1.A
D+
  Top/Horz 0.127: J1.A6 11.18,6.58 11.29,6.68 11.29,7.22 11.43,7.37 U7.5 12.18,7.25 J1.B6
D-  (via drill 0.3)
  Top/Horz 0.127: J1.A7 v11.68,5.08 10.92,5.08 10.68,5.32 J1.B7 | U7.6 v13.34,8.38
  Bottom/Vert 0.127: v11.68,5.08 11.68,6.72 v13.34,8.38
DTR-10K
  Top/Horz 0.127: R17.2 17.4,9.41 17.4,10.03 17.53,10.16 Q2.5
ESP_0/QPWR  (via drill 0.3)
  Top/Horz 0.127: S3.3 v17.65,19.9 S3.4 19.9,19.9 v19.94,19.94 | U5.3 15.4,14.29 16.35,15.24 19.3,15.24 v19.94,14.61 | U2.25 18.46,34.37 v18.41,34.42 | Q2.6 18.85,9.51 v19.3,9.06
  Bottom/Vert 0.127: v18.41,34.42 18.29,34.29 18.29,27.57 18.5,27.35 18.5,26.75 18.29,26.54 18.29,20.54 v17.65,19.9 | v19.94,19.94 v19.94,14.61 20.32,14.22 TP1.P$1 19.3,9.14 v19.3,9.06
ESP_2/RGB_DI  (via drill 0.3)
  Top/Horz 0.127: v14.22,52.32 14.48,52.58 19.56,52.58 20.57,53.59 20.57,53.86 D5.DI | U2.24 17.14,33.91 16.13,34.92 v14.48,34.92
  Bottom/Vert 0.127: v14.22,52.32 14.22,51.69 | 14.22,51.69 14.22,49.52 14.73,49.01 14.73,42.43 14.52,42.21 14.52,36.01 14.39,35.88 14.39,35.49 14.48,35.4 v14.48,34.92 | TP3.P$1 14.22,51.69
ESP_4/TP_FB  (via drill 0.3)
  Top/Horz 0.127: v14.73,51.44 16,51.44 16.64,52.07 v18.29,52.07 | v14.86,35.69 14.91,35.64 U2.26
  Bottom/Vert 0.127: v14.73,51.44 14.77,51.4 14.77,49.34 14.99,49.12 14.99,42.32 14.77,42.1 14.77,35.78 v14.86,35.69 | U6.FREEBIE v18.29,52.07
ESP_5/SD_CS  (via drill 0.3)
  Top/Horz 0.127: U2.29 18.62,39.45 17.98,40.09 17.59,40.09 16.73,39.24 16.05,39.24 15.07,38.27 9.36,38.27 v8.89,38.73
  Bottom/Vert 0.127: J6.CS/DAT3 8.98,15.59 9.14,15.75 9.14,38.48 v8.89,38.73 9.02,38.86 TP4.P$1
ESP_12/TP_12
  Top/Horz 0.127: U6.12 1.35,34.37 U2.14
ESP_13/TP_13/LED
  Top/Horz 0.127: U6.13 6.99,31.75 | 6.99,31.75 7.11,31.75 7.75,31.11 R4.1 | U2.16 6.99,31.75
ESP_14/TP_7  (via drill 0.3)
  Top/Horz 0.127: v5.33,35.69 5.29,35.64 U2.13
  Bottom/Vert 0.127: U6.7 4.95,46.99 5.59,46.35 5.59,35.94 v5.33,35.69
ESP_15/TP_9  (via drill 0.3)
  Top/Horz 0.127: v15.24,34.29 15.24,33.78 15.88,33.15 U2.23 | v4.7,39.75 5.21,39.24 14.48,39.24 v15.24,40.01
  Bottom/Vert 0.127: v4.7,39.75 4.7,41.27 4.06,41.91 U6.9 | v15.24,40.01 15.49,39.75 15.49,34.54 v15.24,34.29
ESP_16/TP_RX  (via drill 0.3)
  Top/Horz 0.127: U2.27 19.29,36.91 18.7,36.32 v17.27,36.32
  Bottom/Vert 0.127: U6.RX 18.59,46.99 17.7,46.1 17.7,45.42 17.49,45.2 17.49,43.86 17.27,43.64 17.27,39.1 17.74,38.63 17.74,37.82 17.27,37.35 v17.27,36.32
ESP_17/TP_TX  (via drill 0.3)
  Top/Horz 0.127: U2.28 18.88,38.18 18.71,38.01 16.98,38.01 v16.76,38.23
  Bottom/Vert 0.127: U6.TX 17.4,49.53 17.11,49.24 17.11,46.8 16.51,46.2 16.51,45.2 16.73,44.98 16.73,44.17 16.51,43.96 16.51,38.48 v16.76,38.23
ESP_18/TP_SCK  (via drill 0.3)
  Top/Horz 0.127: U6.SCK 20.24,40.72 U2.30 16.62,40.72 14.63,38.73 v9.87,38.73
  Bottom/Vert 0.127: J6.SCLK 8.6,12.29 9.65,13.34 9.65,38.52 v9.87,38.73
ESP_19/TP_CIPO  (via drill 0.3)
  Top/Horz 0.127: U6.CIPO 21.59,43.71 20.5,42.62 20.3,42.62 U2.31 18.62,41.99 17.87,41.24 15.81,41.24 14.28,39.71 v10.54,39.71
  Bottom/Vert 0.127: J6.DO/DAT0 8.1,10.6 8.22,10.6 9.91,12.29 9.91,38.1 10.34,38.53 10.34,39.51 v10.54,39.71
ESP_21/TP_SDA  (via drill 0.3)
  Top/Horz 0.127: U2.33 15.79,44.53 v15.75,44.58 | U6.SDA v5.84,52.07 6.1,51.82 14.38,51.82 14.63,52.07 v15.75,52.07 | J3.3 6.23,8.39 8.17,10.32 14.67,10.32 14.76,10.41 v15.11,10.41 | U4.8 5.21,30.59 v5.21,30.99
  Bottom/Vert 0.127: v15.11,10.41 15.75,11.05 v15.75,44.58 v15.75,52.07 | v5.21,30.99 5.84,31.62 v5.84,52.07
ESP_22/TP_SCL  (via drill 0.3)
  Top/Horz 0.127: U2.36 16.3,48.34 v16.22,48.26 15.24,48.26 13.97,49.53 v6.73,49.53 v5.21,49.53 | J3.4 5.99,7.39 6.35,7.75 6.35,8 8.26,9.91 15.49,9.91 v15.88,10.29 | U4.7 v6.1,30.98 v6.1,30.99
  Bottom/Vert 0.127: v16.22,48.26 16,48.04 16,44.99 16.22,44.77 16.22,44.38 16,44.17 16,10.41 v15.88,10.29 | v6.1,30.99 6.1,48.9 v6.73,49.53 | U6.SCL v5.21,49.53
ESP_23/TP_COPI  (via drill 0.3)
  Top/Horz 0.127: v17.78,41.91 v15.24,41.91 | U2.37 15.32,49.61 v15.24,49.53 14.1,50.67 v9.27,50.67
  Bottom/Vert 0.127: U6.COPI v17.78,41.91 | v15.24,41.91 v15.24,49.53 | J6.DI/CMD 8.64,14.49 9.4,15.24 9.4,38.93 9.84,39.37 9.84,40.73 9.4,41.17 9.4,50.55 9.34,50.61 v9.27,50.67
ESP_25/TP_A1  (via drill 0.3)
  Top/Horz 0.127: U2.10 4.08,39.45 5.26,38.28 8.69,38.28 8.95,38.01 15.17,38.01 16.15,38.99 17.14,38.99 v17.78,39.62 | v17.78,27.05 18.16,26.67 U6.A1
  Bottom/Vert 0.127: v17.78,39.62 17.78,38.95 18,38.74 18,37.72 17.69,37.41 17.69,36.78 17.78,36.7 17.78,34.81 17.69,34.72 17.69,34.12 17.78,34.03 v17.78,27.05
ESP_26/TP_A0  (via drill 0.3)
  Top/Horz 0.127: v18.51,38.48 18.26,38.73 16.26,38.73 15.28,37.76 8.84,37.76 8.58,38.02 5.15,38.02 4.99,38.18 U2.11 | v17.65,25.15 20.57,25.15 U6.A0
  Bottom/Vert 0.127: v18.51,38.48 18.51,37.84 17.95,37.28 17.95,36.89 18.03,36.8 18.03,34.7 17.95,34.61 17.95,34.22 18.03,34.13 18.03,27.46 18.25,27.25 18.25,26.86 18.03,26.64 18.03,25.53 v17.65,25.15
ESP_27/TP_11
  Top/Horz 0.127: U6.11 1.35,36.91 U2.12
ESP_32/TP_8
  Top/Horz 0.127: U2.8 2.82,42.37 2.49,42.37 1.27,43.59 U6.8
ESP_33/TP_10
  Top/Horz 0.127: U6.10 1.52,39.37 2.87,40.72 U2.9
ESP_34/TP_A2  (via drill 0.3)
  Top/Horz 0.127: U2.6 7.03,44.53 v7.11,44.45 | v7.68,29.72 8.06,30.1 18.16,30.1 19.05,29.21 U6.A2
  Bottom/Vert 0.127: v7.68,29.72 7.24,30.16 7.24,35.91 7.33,36 7.33,44.23 v7.11,44.45
ESP_35/TP_A5  (via drill 0.3)
  Top/Horz 0.127: v18.41,37.08 7.24,37.08 v6.86,37.47 | U2.7 6.78,43.26 v6.86,43.18
  Bottom/Vert 0.127: U6.A5 18.92,36.83 18.67,37.08 v18.41,37.08 | v6.86,37.47 v6.86,43.18
ESP_36/TP_A4  (via drill 0.3)
  Top/Horz 0.127: U2.4 16.05,47.07 16.44,47.46 v17.65,47.46 | U6.A4 20.57,33.27 18.8,33.27 v17.14,34.92
  Bottom/Vert 0.127: v17.65,47.46 17.45,47.26 17.45,45.52 17.23,45.31 17.23,43.96 17.02,43.75 17.02,39 17.49,38.53 17.49,37.93 16.76,37.2 16.76,35.31 v17.14,34.92
ESP_39/TP_A3  (via drill 0.3)
  Top/Horz 0.127: U2.5 7.54,45.8 v7.62,45.72 | v7.75,30.48 7.87,30.35 18.16,30.35 19.56,31.75 U6.A3
  Bottom/Vert 0.127: v7.62,45.72 7.62,30.61 v7.75,30.48
GND  (via drill 0.3)
  Top/Horz 0.127: D5.GND 21.72,55.74 21.72,54.04 21.6,53.92 21.54,53.92 C5.2 20.57,52.95 | 20.57,52.83 20.57,52.95 | 20.57,52.95 19.67,52.05 U2.38 | U4.6 6.6,29.46 U4.9 6.73,29.21 7.1,28.84 U4.4
  Top/Horz 0.305: v15.24,8.51 15.24,6.59 J1.GND2 14.86,5.81 14.86,5.29 | v14.99,4.32 14.82,4.48 | U7.1 7.62,6.73 7.62,6.59 J1.GND 8.21,5.67 7.9,5.36 | v8.26,22.86 8.26,24 C1.2 8.89,24.77 9.39,25.27 C15.2
  other vias: 4.32,16.76 12.83,15.24 3.81,10.41 3.68,12.7 5.97,6.6 5.46,2.67 17.65,2.54 22.23,6.35 17.65,8 5.97,11.43 15.24,20.7 17.65,21.08 12.32,26.29 14.86,31.11 19.05,27.94 11.18,22.86 6.35,21.72 6.35,29.21 4.83,33.02 11.43,43.18 11.43,41.91 12.7,41.91 12.7,43.18 12.7,44.45 11.43,44.45 11.43,45.72 12.7,45.72 18.29,50.93 4.45,50.93 7.87,4.19 17.78,13.84 13.97,17.27
  pour Bottom/Vert (isolate 0.152): 0,0 0,53.34 22.86,53.34 22.86,0
  pour Top/Horz (isolate 0.152): 22.86,0 22.86,53.34 0,53.34 0,0
N$1  (via drill 0.3)
  Top/Horz 0.127: R34.1 8.39,28.22 v7.66,28.96
  Bottom/Vert 0.127: v7.66,28.96 7.66,28.8 8.14,28.32 JP1.1
N$2
  Top/Horz 0.127: R4.2 D3.A
N$3  (via drill 0.3)
  Top/Horz 0.127: v21.59,57.28 21.59,56.96 D5.DO
  Bottom/Vert 0.127: TP2.P$1 21.84,57.02 v21.59,57.28
N$5  (via drill 0.3)
  Top/Horz 0.127: v12.83,3.5 v12.84,3.5 13.01,3.67 R9.2 | J1.B5 13.18,5.43 v12.83,5.08
  Bottom/Vert 0.127: v12.83,5.08 v12.83,3.5
N$6  (via drill 0.3)
  Top/Horz 0.127: J1.A5 10.18,5.28 v9.86,4.95 | v9.72,3.5 9.7,3.5 9.53,3.67 R10.2
  Bottom/Vert 0.127: v9.86,4.95 9.86,3.63 v9.72,3.5
N$14
  Top/Horz 0.127: U1.5 5.4,26.57 R6.2
N$30
  Top/Horz 0.127: R34.2 D12.A
QWIIC_PWR  (via drill 0.3)
  Top/Horz 0.305: J3.2 6.75,9.39 8.11,10.76 14.44,10.76 v14.48,10.79 | U5.5 15.75,16.19 | 15.75,16.19 15.3,16.19 v15.24,16.13 | C3.1 15.74,16.2 15.75,16.19
  Bottom/Vert 0.305: v15.24,16.13 15.37,16 15.37,11.68 v14.48,10.79
RTS-10K
  Top/Horz 0.127: Q2.2 19.3,10.16 19.05,10.41 19.05,11.56 R18.2
TP_EN  (via drill 0.3)
  Top/Horz 0.127: v13.46,23.62 v13.47,23.61 R8.2 12.38,21.77 U3.3 | U6.EN v3.81,26.67 | v5.08,34.29 v13.46,34.29
  Bottom/Vert 0.127: v3.81,26.67 3.81,33.02 v5.08,34.29 | v13.46,34.29 13.46,25.05 12.99,24.58 12.99,24.09 v13.46,23.62
V_BATT
  Top/Horz 0.305: C15.1 8.26,25.27 8.26,25.02 7.37,24.13 7.3,24.06 | U4.3 6.6,27.68 6.48,27.56 6.1,27.56 | 6.1,27.56 4.94,27.56 4.45,27.06 4.45,24.13 | U4.2 6.1,27.56
  Top/Horz 0.559: U6.V_BATT 4.45,24.13 6.35,24.13 7.37,24.13 | 7.3,24.06 U1.3 7.3,21.78 7.12,21.6 C6.1 7.12,18.92 J4.2 7.53,19.05 Q3.3
V_USB  (via drill 0.3)
  Top/Horz 0.305: 10.92,15.25 R7.2 | R3.1 9.28,28.32 11.05,28.32 11.43,27.94 11.43,26.54 11.05,26.16 v10.67,26.16 | J1.VBUS2 13.88,5.39 13.66,5.18 13.66,5.07 12.91,4.32 v10.54,4.32 9.7,4.32 9.25,4.77 9.25,5.23 8.98,5.5 J1.VBUS1 | C19.1 v17.78,6.35 | 8.21,26.16 8.16,26.16 7.42,25.43 U1.4
  Top/Horz 0.559: 10.92,16.51 10.92,15.25 | D4.A 10.92,16.51 | U6.V_USB v4.45,29.21 | v10.38,18.16 10.44,18.1 10.92,18.1 | Q3.1 10.92,18.1 | 10.92,18.1 10.92,16.51 | v6.35,25.4 7.27,25.4 U1.4 | 8.21,26.16 v10.67,26.16
  Bottom/Vert 0.305: v17.78,6.35 17.78,5.33 14.99,2.54 11.18,2.54 10.54,3.17 v10.54,4.32
  Bottom/Vert 0.559: v4.45,29.21 4.45,27.3 v6.35,25.4 | v10.54,4.32 10.54,7.92 10.24,8.22 10.24,8.79 10.38,8.93 v10.38,18.16 10.38,25.87 v10.67,26.16
VIN
  Top/Horz 0.305: 13.34,19.94 13.34,16.51 | 13.34,16.51 13.65,16.19 U5.1 | D4.C 13.34,16.51 | R8.1 13.34,21.73 13.34,19.94 | 13.34,19.94 13.27,20 Q3.2 11.56,20 10.48,21.08 | 10.48,21.08 U3.1 | C7.1 10.47,21.09 10.48,21.08

### Text on the board
Bottom/Vert: v30
tPlace: + | -
Measures: Units in inches
tDocu: Mike Hord | Revised by: Alex Wende